# Altium schematic sheet module 1_LIGHT.SchDoc
size 263 x 148 mm
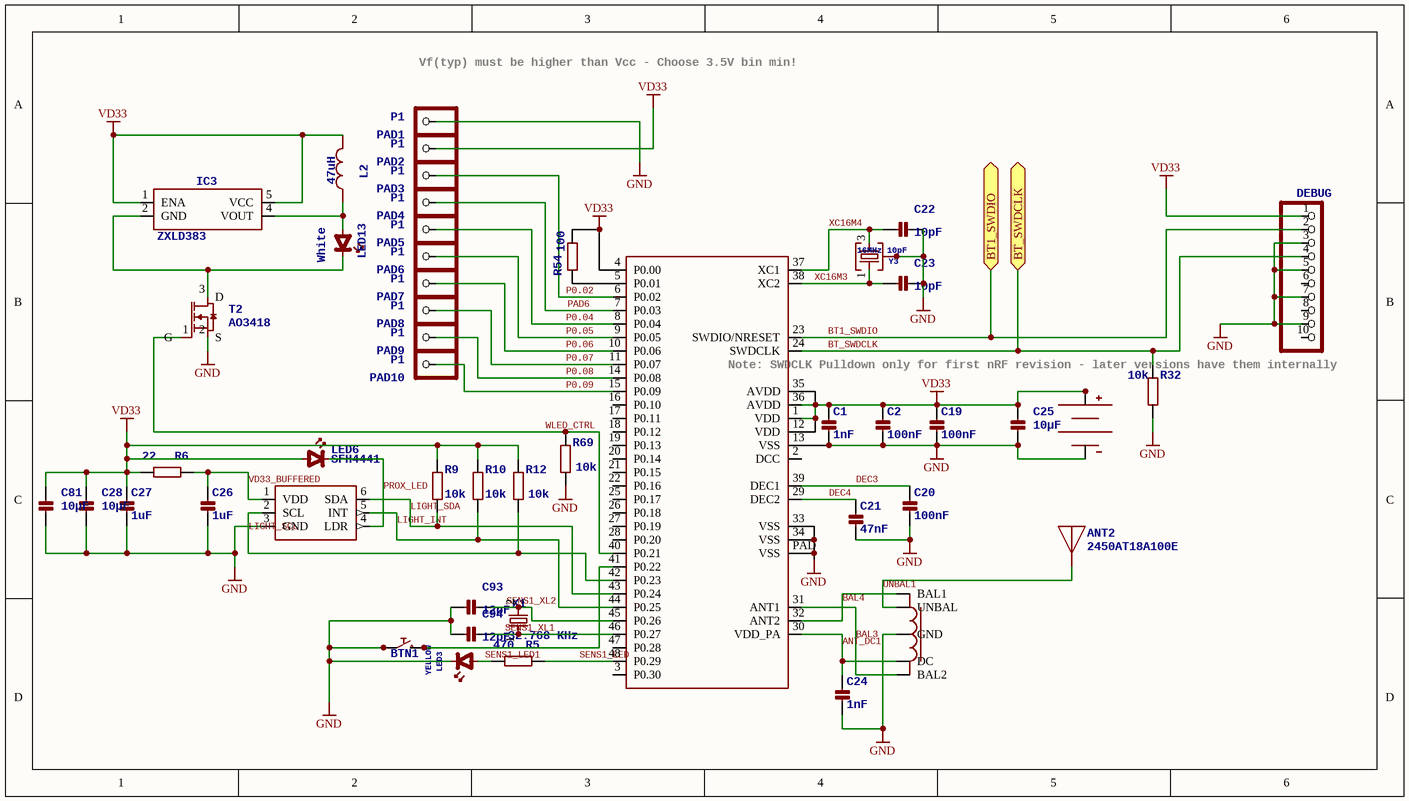
[diagram p0: module 1_LIGHT.SchDoc]

## Parts
ANT2  2450AT18A100E  [1206_MINIMELF_COMBO]
BALUN1  2450BM14A0002T  [6-PIN-0603]  (value not drawn)
BAT1  BATTERYBK-912  [BK-912]  (value not drawn)
BT1  NRF51822QFN48  [QFN48_EP]  (value not drawn)
BTN1  Tact Sw 4.6x2.8  [CK-KMR2]  (value not drawn)
C1  1nF  [0402]
C2  100nF  [0402]
C19  100nF  [0402]
C20  100nF  [0402]
C21  47nF  [0402]
C22  10pF  [0402]
C23  10pF  [0402]
C24  1nF  [0402]
C25  10µF  [0603]
C26  1uF  [0402]
C27  1uF  [0402]
C28  10µF  [0603]
C81  10µF  [0603]
C93  12pF  [0402]
C94  12pF  [0402]
DEBUG1  DEBUG  [2X05_SMT]  (no BOM)
IC3  ZXLD383  [SOT-23-5]
L2  47uH  [0805_MICROMELF_COMBO]
LED3  YELLOW  [0402_POLAR]
LED6  SFH4441  [MIDLED]
LED13  White  [LED3X2]
PAD1  P1  [PCB_MEDIUM_RECT_PAD]  (no BOM)
PAD2  P1  [PCB_MEDIUM_RECT_PAD]  (no BOM)
PAD3  P1  [PCB_MEDIUM_RECT_PAD]  (no BOM)
PAD4  P1  [PCB_MEDIUM_RECT_PAD]  (no BOM)
PAD5  P1  [PCB_MEDIUM_RECT_PAD]  (no BOM)
PAD6  P1  [PCB_MEDIUM_RECT_PAD]  (no BOM)
PAD7  P1  [PCB_MEDIUM_RECT_PAD]  (no BOM)
PAD8  P1  [PCB_MEDIUM_RECT_PAD]  (no BOM)
PAD9  P1  [PCB_MEDIUM_RECT_PAD]  (no BOM)
PAD10  P1  [PCB_MEDIUM_RECT_PAD]  (no BOM)
R5  470  [0402]
R6  22  [0402]
R9  10k  [0402]
R10  10k  [0402]
R12  10k  [0402]
R32  10k  [0402]
R54  100  [0402]
R69  10k  [0402]
SENSE3  TCS37717FN  [DFN-6-0.65]  (value not drawn)
T2  AO3418  [SOT23]
X1  32.768 KHz  [1206_MINIMELF_COMBO]
Y3  16MHz 10pF  [CRYSTAL25X20]

## Ports
BT1_SWDIO, BT_SWDCLK

## Nets
GND: BALUN1.2(GND) BAT1.- BT1.13(VSS) BT1.33(VSS) BT1.34(VSS) BT1.PAD(VSS) BTN1.P1 BTN1.P2 C1.2 C2.2 C19.2 C20.2 C21.2 C22.2 C23.2 C24.2 C25.2(P2) C26.2 C27.2 C28.2(P2) C81.2(P2) C93.1 C94.1 DEBUG1.3 DEBUG1.5 DEBUG1.7 DEBUG1.9 LED3.K(CATHODE) PAD1.1 R32.1 R69.1 SENSE3.3(GND) T2.2(S) Y3.2 Y3.4
VD33: BAT1.+1(+) BAT1.+2(+) BT1.1(VDD) BT1.4(P0.00) BT1.12(VDD) BT1.35(AVDD) BT1.36(AVDD) C1.1 C2.1 C19.1 C25.1(P1) C27.1 C28.1(P1) C81.1(P1) DEBUG1.1 IC3.1(ENA) IC3.5(VCC) L2.2 LED6.A(ANODE) PAD2.1 R6.1 R9.2 R10.2 R12.2 R54.1
ANT_DC1: BALUN1.5(DC) BT1.30(VDD_PA) C24.1
BAL3: BALUN1.4(BAL2) BT1.31(ANT1)
BAL4: BALUN1.3(BAL1) BT1.32(ANT2)
BT1_SWDIO: BT1.23(SWDIO/NRESET) DEBUG1.2 ; port BT1_SWDIO
BT_SWDCLK: BT1.24(SWDCLK) DEBUG1.4 R32.2 ; port BT_SWDCLK
DEC3: BT1.39(DEC1) C20.1
DEC4: BT1.29(DEC2) C21.1
LIGHT_INT: BT1.44(P0.25) R10.1 SENSE3.5(INT)
LIGHT_SCL: BT1.42(P0.23) R12.1 SENSE3.2(SCL)
LIGHT_SDA: BT1.43(P0.24) R9.1 SENSE3.6(SDA)
P0.02: BT1.6(P0.02) PAD3.1
P0.04: BT1.8(P0.04) PAD5.1
P0.05: BT1.9(P0.05) PAD6.1
P0.06: BT1.10(P0.06) PAD7.1
P0.07: BT1.11(P0.07) PAD8.1
P0.08: BT1.14(P0.08) PAD9.1
P0.09: BT1.15(P0.09) PAD10.1
PAD6: BT1.7(P0.03) PAD4.1
PROX_LED: LED6.C(CATHODE) SENSE3.4(LDR)
SENS1_LED: BT1.48(P0.29) R5.1
SENS1_LED1: LED3.A(ANODE) R5.2
SENS1_XL1: BT1.46(P0.27) C94.2 X1.1
SENS1_XL2: BT1.45(P0.26) C93.2 X1.2
UNBAL1: ANT2.1(ANT) BALUN1.1(UNBAL)
VD33_BUFFERED: C26.1 R6.2 SENSE3.1(VDD)
WLED_CTRL: BT1.40(P0.21) R69.2 T2.1(G)
XC16M3: BT1.38(XC2) C23.1 Y3.1
XC16M4: BT1.37(XC1) C22.1 Y3.3
NetBT1_5: BT1.5(P0.01) R54.2
NetBT1_41: BT1.41(P0.22) BTN1.P3 BTN1.P4
NetIC3_2: IC3.2(GND) LED13.K(CATHODE) T2.3(D)
NetIC3_4: IC3.4(VOUT) L2.1 LED13.A(ANODE)

Not connected (* = marked no-connect by the designer): BT1 2(DCC) 3(P0.30) 16(P0.10) 17(P0.11) 18(P0.12) 19(P0.13) 20(P0.14) 21(P0.15) 22(P0.16) 25(P0.17) 26(P0.18) 27(P0.19) 28(P0.20) 47(P0.28); DEBUG1 6 8 10

## Notes on the sheet
- Vf(typ) must be higher than Vcc - Choose 3.5V bin min!
- (near BT1) Note: SWDCLK Pulldown only for first nRF revision - later versions have them internally

## Library data of the parts
ANT2 = ANTENNA_MONOPOLE1206: 2.45 GHz Antenna; SMD: Yes
BALUN1 = BALUN: 2.45 GHz Impedance Matched Balun-Filter; SMD: Yes
BAT1 = BATTERYBK-912: Coin battery holder; SMD: Yes
BT1 = NRF51822QFN48: Nordic Bluetooth 4.0 low energy modul; SMD: Yes
BTN1 = PUSHBUTTONKMR2XX: Push button; SMD: Yes
C1 C2 C19-C24 C26 C27 C93 C94 = CAP_CERAMIC0402: Ceramic Capacitor; SMD: Yes
C25 C28 C81 = CAP_CERAMIC0603: Ceramic Capacitor; SMD: Yes
DEBUG1 = HEADER-2X5SMD-1.27MM: cortex DEBUG connector
IC3 = ZXLD383SOT23-5: Diodes Inc. boost LED driver; SMD: Yes
L2 = INDUCTOR0805: Inductor; SMD: Yes
LED3 = LED0402: LED common; SMD: Yes
LED6 = LEDMIDLED: LED IR emitter 950NM; SMD: Yes
LED13 = LED3X2: LED common; SMD: Yes
PAD1-PAD10 = HEADER-1X1SMD_MEDIUM: <b>PIN HEADER</b>
R5 R6 R9 R10 R12 R32 R54 R69 = R-EU_0402: RESISTOR; SMD: Yes
SENSE3 = TCS3771: TAOS/ams color/light/proximity sensor; SMD: Yes
T2 = NMOS_ENH: N-Channel MOSFET, enhancement mode; SMD: Yes
X1 = CRYSTAL1206: CL05C120JB5; 1: 1; 2: 2; SMD: Yes
Y3 = CRYSTAL_WITH_GROUND25X20: 16MHz crystal 2.5x2mm; SMD: Yes